# EAGLE schematic 8x8_dot_matrix_3color_led_display (EAGLE 5.10)
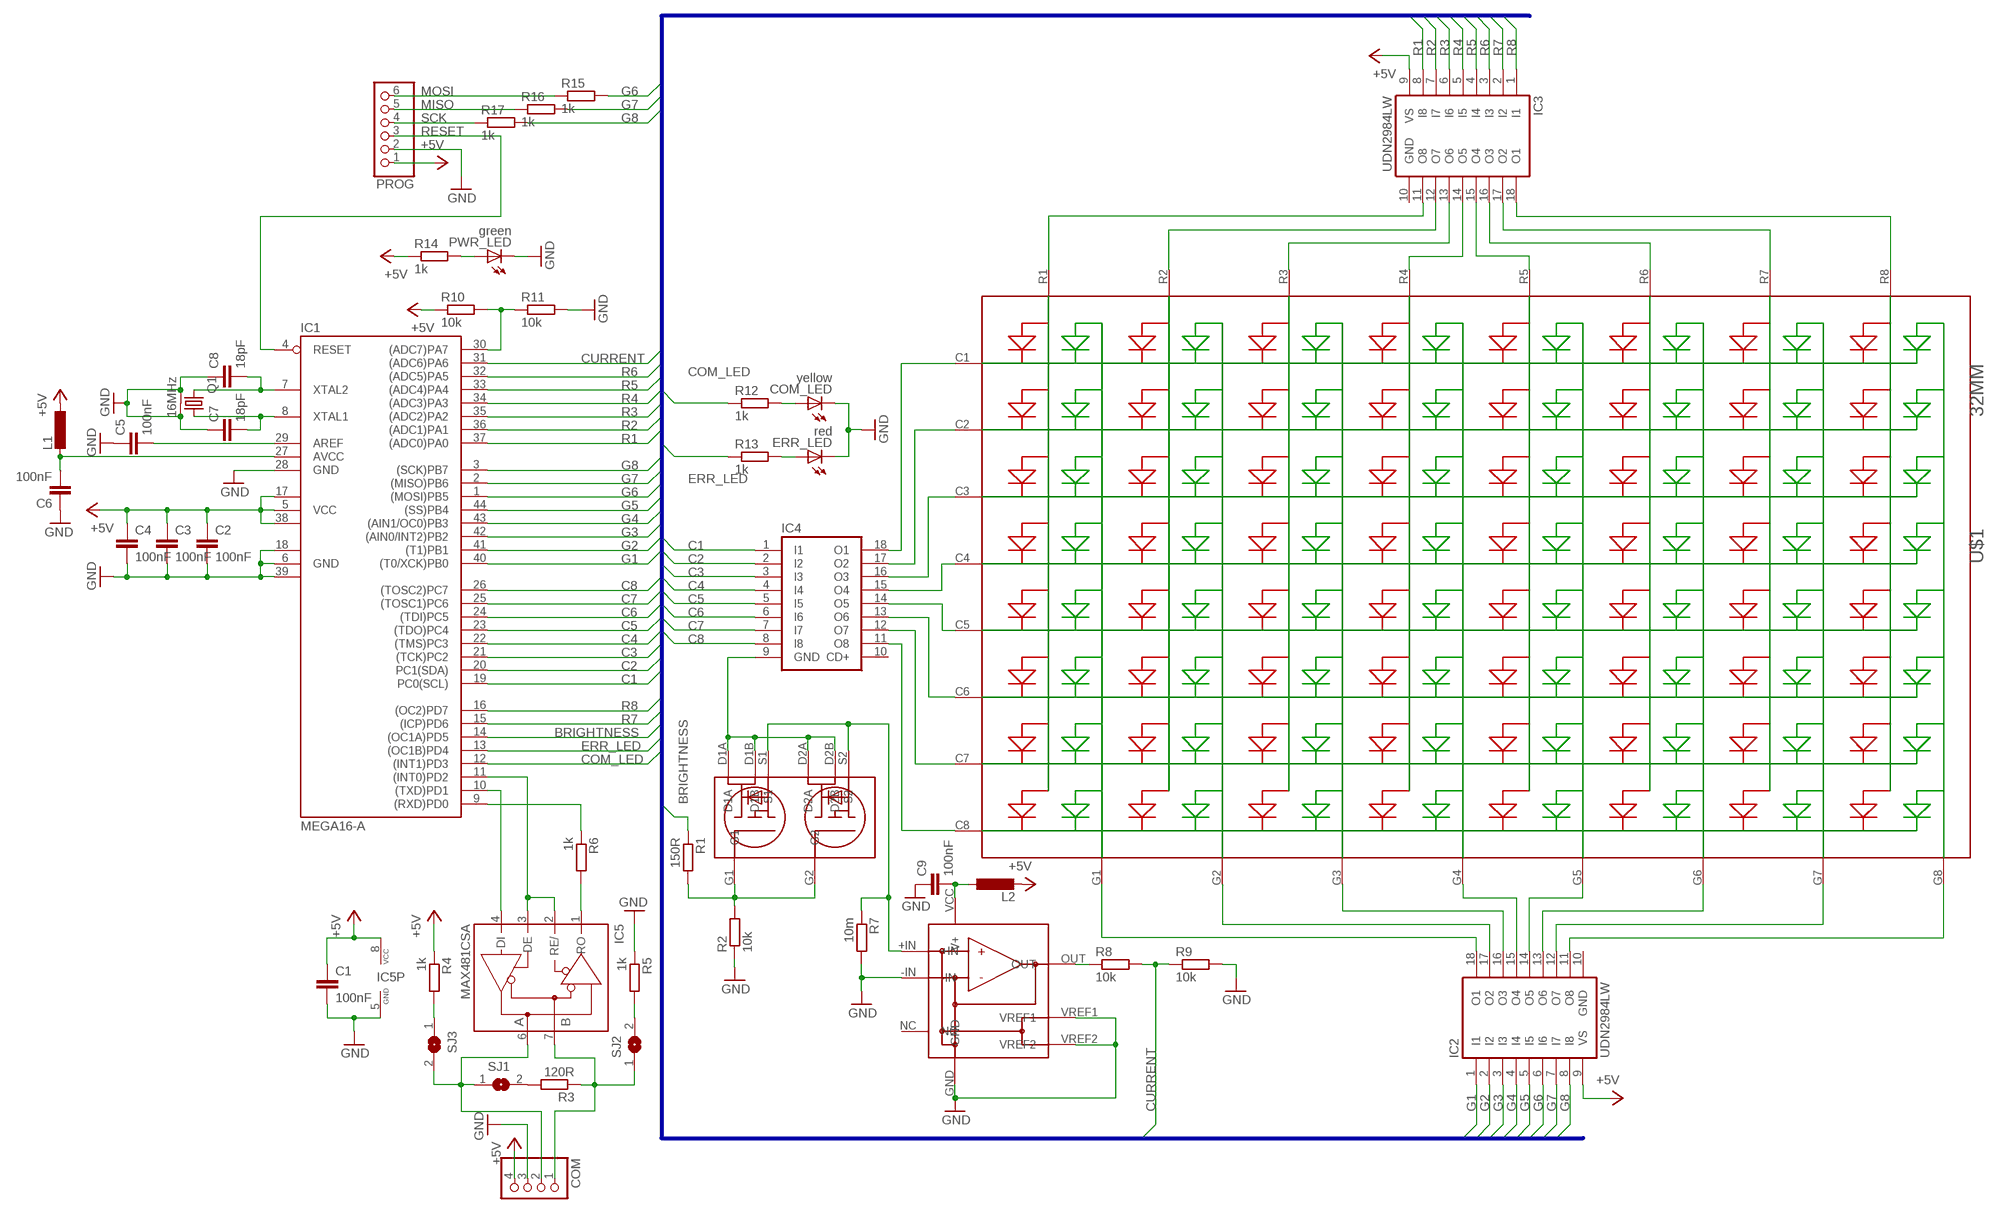
[diagram p0: schematic, sheet 1]

## Parts
C1  100nF  C-EUC1206  [C1206]
C2  100nF  C-EUC0603  [C0603]
C3  100nF  C-EUC0603  [C0603]
C4  100nF  C-EUC0603  [C0603]
C5  100nF  C-EUC0603  [C0603]
C6  100nF  C-EUC0603  [C0603]
C7  18pF  C-EUC0603  [C0603]
C8  18pF  C-EUC0603  [C0603]
C9  100nF  C-EUC0603  [C0603]
COM  PINHD-1X4/90  [1X04/90]
COM_LED  yellow  LEDCHIP-LED0603  [CHIP-LED0603]
ERR_LED  red  LEDCHIP-LED0603  [CHIP-LED0603]
IC1  MEGA16-A  [TQFP44]
IC2  UDN2984LW  [SO18W]
IC3  UDN2984LW  [SO18W]
IC4  ULN2803ASMD  [SO18W]
IC5  MAX481CSA  [SO08]
L1  L-EUL1812  [L1812]
L2  L-EUL1812  [L1812]
PROG  PINHD-1X6/90  [1X06/90]
PWR_LED  green  LEDCHIP-LED0603  [CHIP-LED0603]
Q1  16MHz  ABM8  [ABM8]
R1  150R  R-EU_R0603  [R0603]
R2  10k  R-EU_R0603  [R0603]
R3  120R  R-EU_R0805  [R0805]
R4  1k  R-EU_R0603  [R0603]
R5  1k  R-EU_R0603  [R0603]
R6  1k  R-EU_R0603  [R0603]
R7  10m  R-EU_R1206  [R1206]
R8  10k  R-EU_R0603  [R0603]
R9  10k  R-EU_R0603  [R0603]
R10  10k  R-EU_R0603  [R0603]
R11  10k  R-EU_R0603  [R0603]
R12  1k  R-EU_R0603  [R0603]
R13  1k  R-EU_R0603  [R0603]
R14  1k  R-EU_R0603  [R0603]
R15  1k  R-EU_R0603  [R0603]
R16  1k  R-EU_R0603  [R0603]
R17  1k  R-EU_R0603  [R0603]
SJ1  SJ  [SJ]
SJ2  SJ  [SJ]
SJ3  SJ  [SJ]
U$1  32MM  [32MM]
U$2  CEM9926  [SO8]
U$3  AD8205  [SOIC8]

## Nets
+5V: C1.1 C2.1 C3.1 C4.1 COM.4 IC1.5(VCC) IC1.17(VCC1) IC1.38(VCC2) IC2.9(VS) IC3.9(VS) IC5.8(VCC) L1.1 L2.2 PROG.1 R4.1 R10.1 R14.1
BRIGHTNESS: IC1.14((OC1A)PD5) R1.1
C1: IC1.19(PC0(SCL)) IC4.1(I1)
C2: IC1.20(PC1(SDA)) IC4.2(I2)
C3: IC1.21((TCK)PC2) IC4.3(I3)
C4: IC1.22((TMS)PC3) IC4.4(I4)
C5: IC1.23((TDO)PC4) IC4.5(I5)
C6: IC1.24((TDI)PC5) IC4.6(I6)
C7: IC1.25((TOSC1)PC6) IC4.7(I7)
C8: IC1.26((TOSC2)PC7) IC4.8(I8)
COM_LED: IC1.12((INT1)PD3) R12.1
CURRENT: IC1.31((ADC6)PA6) R8.2 R9.1
ERR_LED: IC1.13((OC1B)PD4) R13.1
G1: IC1.40((T0/XCK)PB0) IC2.1(I1)
G2: IC1.41((T1)PB1) IC2.2(I2)
G3: IC1.42((AIN0/INT2)PB2) IC2.3(I3)
G4: IC1.43((AIN1/OC0)PB3) IC2.4(I4)
G5: IC1.44((SS)PB4) IC2.5(I5)
G6: IC1.1((MOSI)PB5) IC2.6(I6) R15.2
G7: IC1.2((MISO)PB6) IC2.7(I7) R16.2
G8: IC1.3((SCK)PB7) IC2.8(I8) R17.2
GND: C1.2 C2.2 C3.2 C4.2 C5.1 C6.1 C7.1 C8.1 C9.1 COM.3 COM_LED.C ERR_LED.C IC1.6(GND) IC1.18(GND1) IC1.28(GND) IC1.39(GND2) IC5.5(GND) PROG.2 PWR_LED.C Q1.GND$1 Q1.GND$2 R2.1 R5.1 R7.2 R9.2 R11.2 U$3.-IN U$3.GND U$3.VREF1 U$3.VREF2
MISO: PROG.5 R16.1
MOSI: PROG.6 R15.1
N$1: IC4.11(O8) U$1.C8
N$2: IC4.12(O7) U$1.C7
N$3: IC4.13(O6) U$1.C6
N$4: IC4.14(O5) U$1.C5
N$5: IC4.15(O4) U$1.C4
N$6: IC4.18(O1) U$1.C1
N$7: IC4.17(O2) U$1.C2
N$8: IC4.16(O3) U$1.C3
N$9: IC2.18(O1) U$1.G1
N$10: IC2.17(O2) U$1.G2
N$11: IC2.16(O3) U$1.G3
N$12: IC2.15(O4) U$1.G4
N$13: IC2.14(O5) U$1.G5
N$14: IC2.13(O6) U$1.G6
N$15: IC2.12(O7) U$1.G7
N$16: IC2.11(O8) U$1.G8
N$17: IC3.11(O8) U$1.R1
N$18: IC3.12(O7) U$1.R2
N$19: IC3.13(O6) U$1.R3
N$20: IC3.14(O5) U$1.R4
N$21: IC3.15(O4) U$1.R5
N$22: IC3.16(O3) U$1.R6
N$23: IC3.17(O2) U$1.R7
N$24: IC3.18(O1) U$1.R8
N$25: IC4.9(GND) U$2.D1A U$2.D1B U$2.D2A U$2.D2B
N$26: R1.2 R2.2 U$2.G1 U$2.G2
N$27: R3.2 SJ1.2
N$28: COM.2 IC5.6(A) SJ1.1 SJ3.2
N$29: COM.1 IC5.7(B) R3.1 SJ2.1
N$30: R4.2 SJ3.1
N$31: R5.2 SJ2.2
N$32: IC5.1(RO) R6.2
N$33: IC1.11((INT0)PD2) IC5.2(RE/) IC5.3(DE)
N$34: IC1.10((TXD)PD1) IC5.4(DI)
N$35: IC1.9((RXD)PD0) R6.1
N$36: R7.1 U$2.S1 U$2.S2 U$3.+IN
N$37: PWR_LED.A R14.2
N$39: R8.1 U$3.OUT
N$40: IC1.30((ADC7)PA7) R10.2 R11.1
N$41: COM_LED.A R12.2
N$42: ERR_LED.A R13.2
N$43: C9.2 L2.1 U$3.VCC(V+)
N$44: C6.2 IC1.27(AVCC) L1.2
N$45: C5.2 IC1.29(AREF)
N$46: C8.2 IC1.7(XTAL2) Q1.Q$1
N$47: C7.2 IC1.8(XTAL1) Q1.Q$2
R1: IC1.37((ADC0)PA0) IC3.8(I8)
R2: IC1.36((ADC1)PA1) IC3.7(I7)
R3: IC1.35((ADC2)PA2) IC3.6(I6)
R4: IC1.34((ADC3)PA3) IC3.5(I5)
R5: IC1.33((ADC4)PA4) IC3.4(I4)
R6: IC1.32((ADC5)PA5) IC3.3(I3)
R7: IC1.15((ICP)PD6) IC3.2(I2)
R8: IC1.16((OC2)PD7) IC3.1(I1)
RESET: IC1.4(RESET) PROG.3
SCK: PROG.4 R17.1
Unconnected: IC4.10(CD+) U$3.NC

## Buses
DISP_BUS:R[1..8],G[1..8],C[1..8],BRIGHTNESS,CURRENT,COM_LED,ERR_LED

## Power pins joined to a net without a drawn wire
GND: IC2.10(GND) IC3.10(GND)

## Library data of the parts
C1-C9 = rcl:C-EU: CAPACITOR, European symbol
COM = pinhead:PINHD-1X4: PIN HEADER
COM_LED ERR_LED PWR_LED = led:LED: LED OSRAM: - CHIPLED LG R971, LG N971, LY N971, LG Q971, LY Q971, LO R971, LY R971 LH N974, LH R974 LS Q976, LO Q976, LY Q976 LO Q996 - Hyper CHIPLED LW Q18S LB Q993, LB Q99A, LB R99A - SideLED LS A670, LO A670, LY A670, LG A670, LP A670 LB A673, LV A673, LT A673, LW A673 LH A674 LY A675 LS A676, LA A676, LO A676, LY A676, LW A676 LS A679, LY A679, LG A679 - Hyper Micro SIDELED® LS Y876, LA Y876, LO Y876, LY Y876 LT Y87S - SmartLED LW L88C, LW L88S LB L89C, LB L89S, LG L890 LS L89K, LO L89K, LY L89K LS L896, LA L896, LO L896, LY L896 - TOPLED LS T670, LO T670, LY T670, LG T670, LP T670 LSG T670, LSP T670, LSY T670, LOP T670, LYG T670 LG T671, LOG T671, LSG T671 LB T673, LV T673, LT T673, LW T673 LH T674 LS T676, LA T676, LO T676, LY T676, LB T676, LH T676, LSB T676, LW T676 LB T67C, LV T67C, LT T67C, LS T67K, LO T67K, LY T67K, LW E67C LS E67B, LA E67B, LO E67B, LY E67B, LB E67C, LV E67C, LT E67C LW T67C LS T679, LY T679, LG T679 LS T770, LO T770, LY T770, LG T770, LP T770 LB T773, LV T773, LT T773, LW T773 LH T774 LS E675, LA E675, LY E675, LS T675 LS T776, LA T776, LO T776, LY T776, LB T776 LHGB T686 LT T68C, LB T68C - Hyper Mini TOPLED® LB M676 - Mini TOPLED Santana® LG M470 LS M47K, LO M47K, LY M47K Source: http://www.osram.convergy.de LUXEON: - LUMILED® LXK2-PW12-R00, LXK2-PW12-S00, LXK2-PW14-U00, LXK2-PW14-V00 LXK2-PM12-R00, LXK2-PM12-S00, LXK2-PM14-U00 LXK2-PE12-Q00, LXK2-PE12-R00, LXK2-PE12-S00, LXK2-PE14-T00, LXK2-PE14-U00 LXK2-PB12-K00, LXK2-PB12-L00, LXK2-PB12-M00, LXK2-PB14-N00, LXK2-PB14-P00, LXK2-PB14-Q00 LXK2-PR12-L00, LXK2-PR12-M00, LXK2-PR14-Q00, LXK2-PR14-R00 LXK2-PD12-Q00, LXK2-PD12-R00, LXK2-PD12-S00 LXK2-PH12-R00, LXK2-PH12-S00 LXK2-PL12-P00, LXK2-PL12-Q00, LXK2-PL12-R00 Source: www.luxeon.com KINGBRIGHT: KA-3528ASYC Source: www.kingbright.com
IC1 = atmel:MEGA16: MICROCONTROLLER 16 Kbytes FLASH 1 kbytes SRAM 512 bytes EEPROM USART 8-channel 10 bit ADC Source: avr.lbr
IC2 IC3 = uln-udn:UDN298*: DRIVER ARRAY Source: Allegro Microsystems Inc. / UDN2981-UDN2984.pdf
IC4 = uln-udn:ULN2803A: DRIVER ARRAY
IC5 = maxim:MAX481CSA: RS485 TRANSEIVER
L1 L2 = rcl:L-EU: INDUCTOR, European symbol
PROG = pinhead:PINHD-1X6: PIN HEADER
Q1 = crystal:ABM8
R1-R17 = rcl:R-EU_: RESISTOR, European symbol
SJ1-SJ3 = jumper:SJ: SMD solder JUMPER
U$1 = displayled8x8:32MM: 8x8 dot matrix red + green led display common catode
U$2 = unipolartransistor:CEM9926
U$3 = oa:AD8205